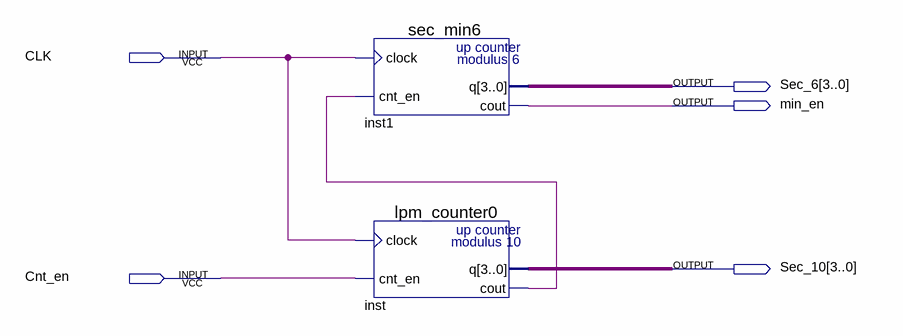
[diagram p0: schematic sheet]
// Quartus schematic time60.bdf as structural Verilog: 2 symbols, 5 pins
module time60 (
  input  CLK,
  input  Cnt_en,
  output [3:0] Sec_6,
  output min_en,
  output [3:0] Sec_10
);

  wire inst_cout;

  sec_min6 inst1 (.clock(CLK), .cnt_en(inst_cout), .q(Sec_6), .cout(min_en));
  lpm_counter0 inst (.clock(CLK), .cnt_en(Cnt_en), .q(Sec_10), .cout(inst_cout));
endmodule
